# Altium schematic sheet [07] - USB-hub.SchDoc
size A3; DocumentNumber: 9; SheetNumber: 8; SheetTotal: 9
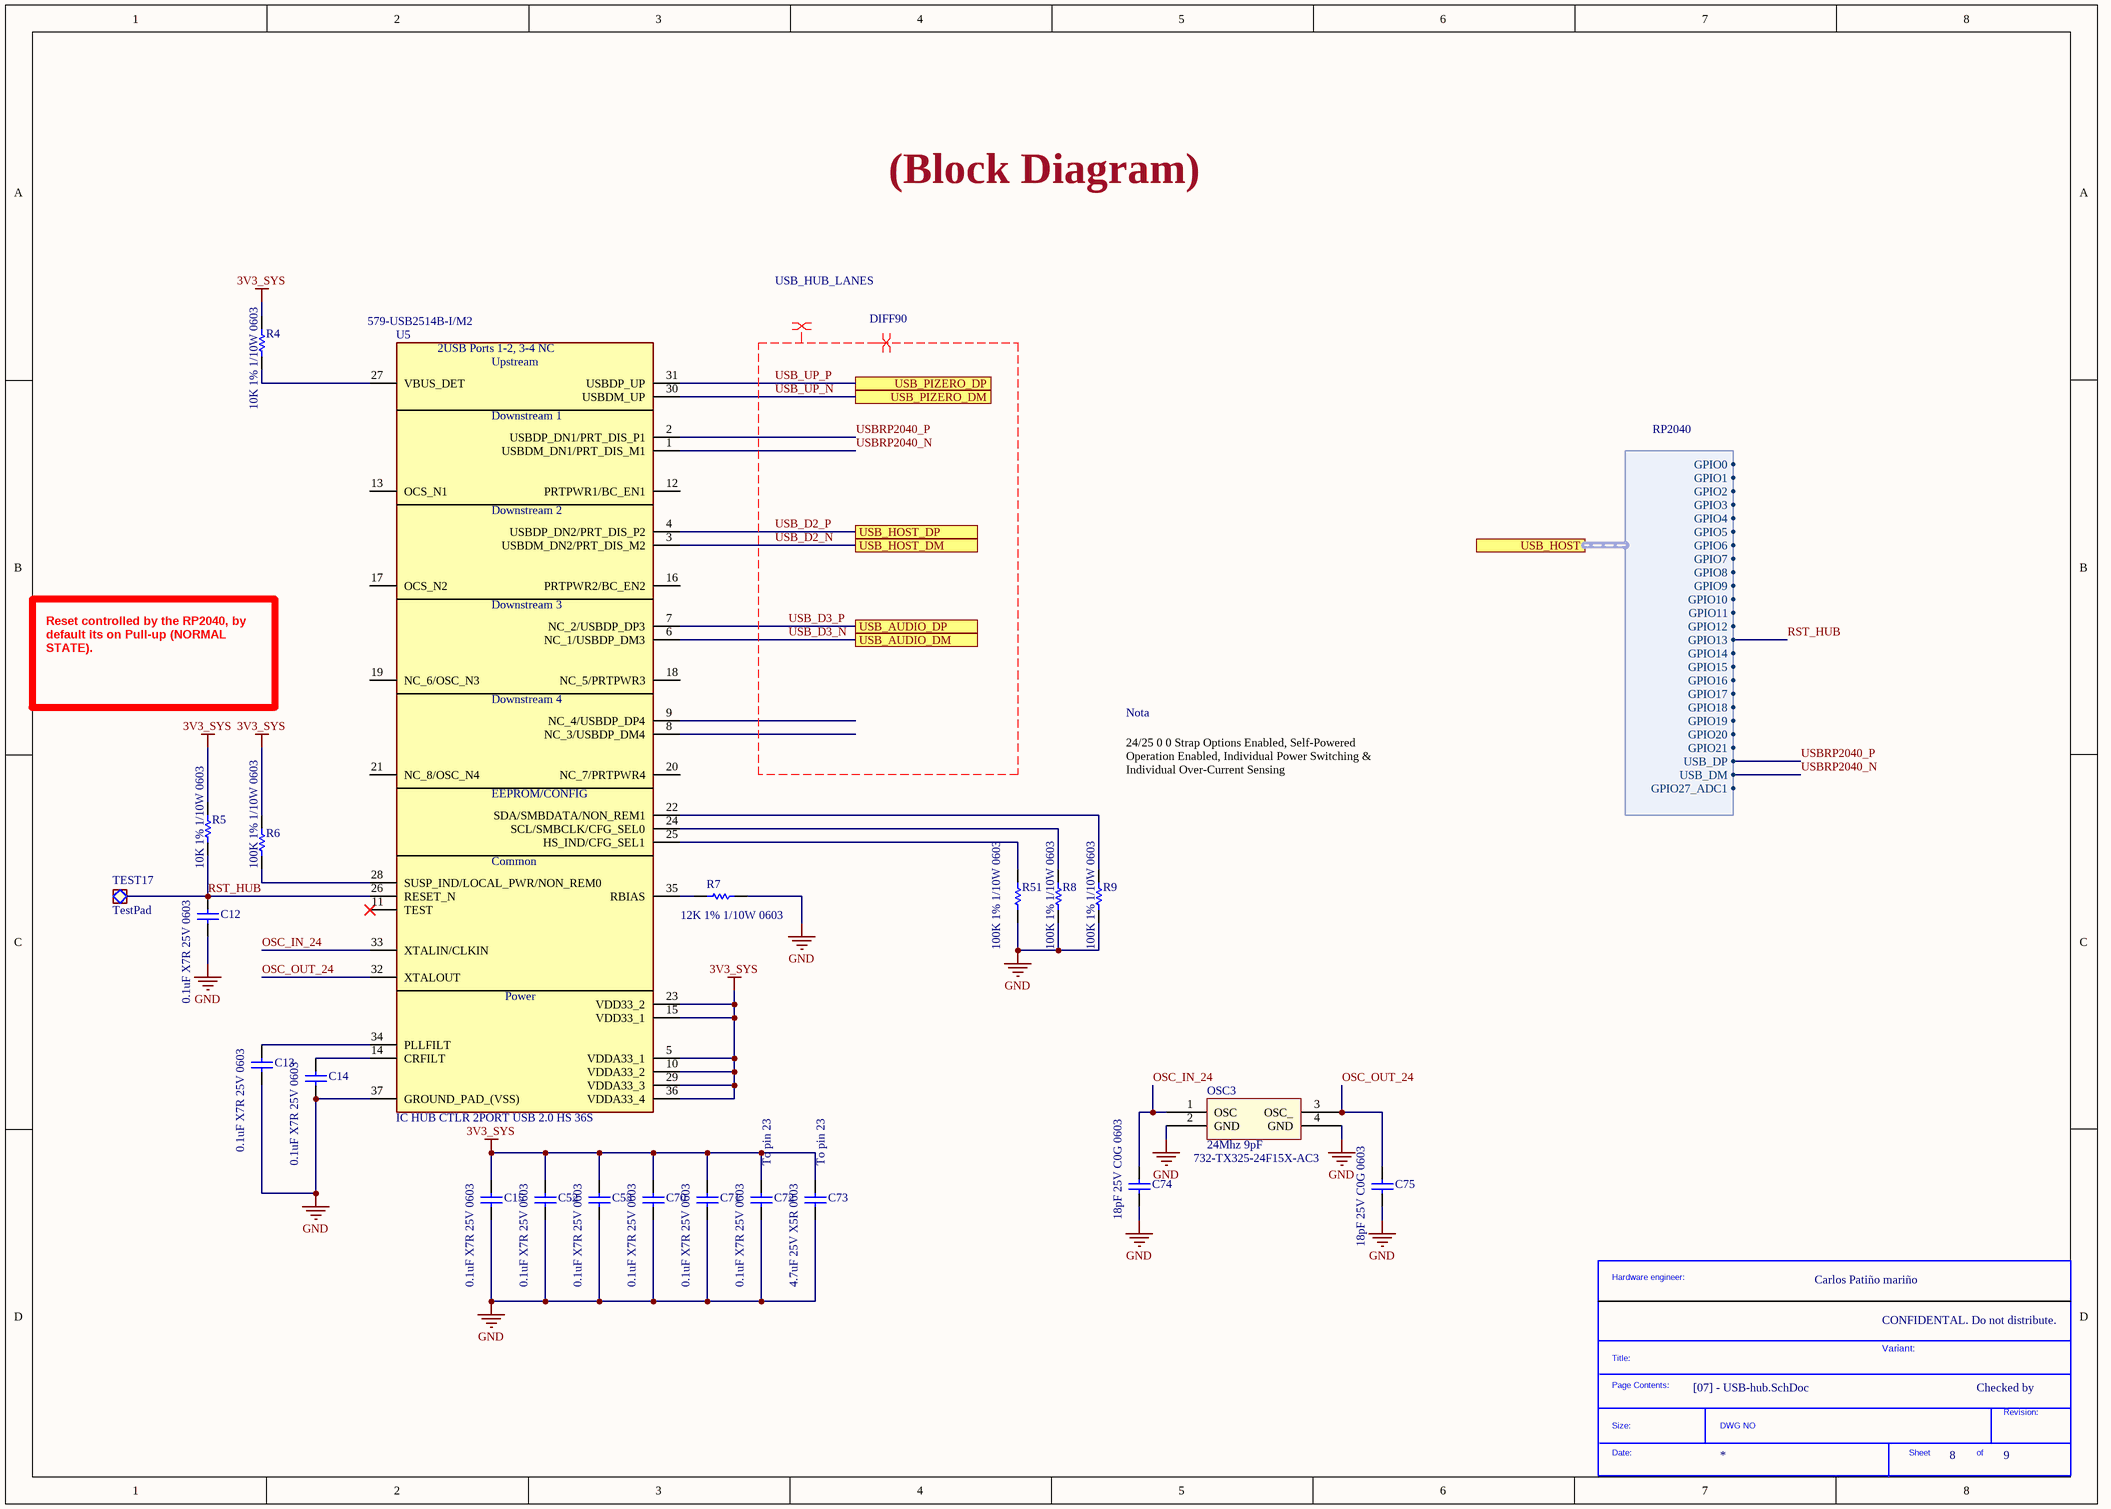
[diagram p0: [07] - USB-hub.SchDoc]

## Parts
*  SDTitleBlock  (value not drawn)  (graphical)
C12  0.1uF X7R 25V 0603  [C 0603/1608]
C13  0.1uF X7R 25V 0603  [C 0603/1608]
C14  0.1uF X7R 25V 0603  [C 0603/1608]
C15  0.1uF X7R 25V 0603  [C 0603/1608]
C52  0.1uF X7R 25V 0603  [C 0603/1608]
C53  0.1uF X7R 25V 0603  [C 0603/1608]
C70  0.1uF X7R 25V 0603  [C 0603/1608]
C71  0.1uF X7R 25V 0603  [C 0603/1608]
C72  0.1uF X7R 25V 0603  [C 0603/1608]
C73  4.7uF 25V X5R 0603  [C 0603/1608]
C74  18pF 25V C0G 0603  [C 0603/1608]
C75  18pF 25V C0G 0603  [C 0603/1608]
OSC3  24Mhz 9pF  Supplier Part Number 1: 732-TX325-24F15X-AC3  [3.2 mm x 2.5 mm(SMD 3225]
R4  10K 1% 1/10W 0603  [R 0603/1608]
R5  10K 1% 1/10W 0603  [R 0603/1608]
R6  100K 1% 1/10W 0603  [R 0603/1608]
R7  12K 1% 1/10W 0603  [R 0603/1608]
R8  100K 1% 1/10W 0603  [R 0603/1608]
R9  100K 1% 1/10W 0603  [R 0603/1608]
R51  100K 1% 1/10W 0603  [R 0603/1608]
TEST17  TestPad  [TestPad]  (no BOM)
U5  IC HUB CTLR 2PORT USB 2.0 HS 36S  Supplier Part Number 1: 579-USB2514B-I/M2  [QFN50P600X600X100-37N-D]

## Ports
USB_AUDIO_DM, USB_AUDIO_DP, USB_HOST (harness RP2040), USB_HOST_DM, USB_HOST_DP, USB_PIZERO_DM, USB_PIZERO_DP

## Harnesses
RP2040: GPIO0, GPIO1, GPIO2, GPIO3, USB_DP, USB_DM, GPIO27_ADC1, GPIO4, GPIO5, GPIO6, GPIO7, GPIO8, GPIO9, GPIO10, GPIO11, GPIO12, GPIO13, GPIO14, GPIO15, GPIO16, GPIO17, GPIO18, GPIO19, GPIO20, GPIO21

## Nets
3V3_SYS: C15.1 C52.1 C53.1 C70.1 C71.1 C72.1 C73.1 R4.2 R5.2 R6.2 U5.5(VDDA33_1) U5.10(VDDA33_2) U5.15(VDD33_1) U5.23(VDD33_2) U5.29(VDDA33_3) U5.36(VDDA33_4)
GND: C12.2 C13.2 C14.2 C15.2 C52.2 C53.2 C70.2 C71.2 C72.2 C73.2 C74.2 C75.2 OSC3.2(GND) OSC3.4(GND) R7.2 R8.1 R9.1 R51.1 U5.37(GROUND_PAD_(VSS))
OSC_IN_24: C74.1 OSC3.1(OSC) U5.33(XTALIN/CLKIN)
OSC_OUT_24: C75.1 OSC3.3(OSC_) U5.32(XTALOUT)
RST_HUB: C12.1 R5.1 TEST17.1 U5.26(RESET_N) ; port USB_HOST.GPIO13
USB_D2_N: U5.3(USBDM_DN2/PRT_DIS_M2) ; port USB_HOST_DM
USB_D2_P: U5.4(USBDP_DN2/PRT_DIS_P2) ; port USB_HOST_DP
USB_D3_N: U5.6(NC_1/USBDP_DM3) ; port USB_AUDIO_DM
USB_D3_P: U5.7(NC_2/USBDP_DP3) ; port USB_AUDIO_DP
USB_UP_N: U5.30(USBDM_UP) ; port USB_PIZERO_DM
USB_UP_P: U5.31(USBDP_UP) ; port USB_PIZERO_DP
USBRP2040_N: U5.1(USBDM_DN1/PRT_DIS_M1) ; port USB_HOST.USB_DM
USBRP2040_P: U5.2(USBDP_DN1/PRT_DIS_P1) ; port USB_HOST.USB_DP
NetC13_1: C13.1 U5.34(PLLFILT)
NetC14_1: C14.1 U5.14(CRFILT)
NetR4_1: R4.1 U5.27(VBUS_DET)
NetR6_1: R6.1 U5.28(SUSP_IND/LOCAL_PWR/NON_REM0)
NetR7_1: R7.1 U5.35(RBIAS)
NetR8_2: R8.2 U5.24(SCL/SMBCLK/CFG_SEL0)
NetR9_2: R9.2 U5.22(SDA/SMBDATA/NON_REM1)
NetR51_2: R51.2 U5.25(HS_IND/CFG_SEL1)

Not connected (* = marked no-connect by the designer): U5 8(NC_3/USBDP_DM4) 9(NC_4/USBDP_DP4) 11(TEST)* 12(PRTPWR1/BC_EN1) 13(OCS_N1) 16(PRTPWR2/BC_EN2) 17(OCS_N2) 18(NC_5/PRTPWR3) 19(NC_6/OSC_N3) 20(NC_7/PRTPWR4) 21(NC_8/OSC_N4)

## Layout directives
differential pair; net class DIFF90: USB_D2_N, USB_D2_P, USB_D3_N, USB_D3_P, USB_UP_N, USB_UP_P, USBRP2040_N, USBRP2040_P
net class USB_HUB_LANES; rule Differential Pairs Routing [Pref Gap = 0.18mm    Min Gap  = 0.18mm    Max Gap  = 0.18mmPref Width = 0.15mm    Min Width  = 0.15mm    Max Width  = 0.15mm]: USB_D2_N, USB_D2_P, USB_D3_N, USB_D3_P, USB_UP_N, USB_UP_P, USBRP2040_N, USBRP2040_P

## Notes on the sheet
- (Block Diagram)
- Reset controlled by the RP2040, by default its on Pull-up (NORMAL STATE).
- Nota
- 24/25 0 0 Strap Options Enabled, Self-Powered Operation Enabled, Individual Power Switching & Individual Over-Current Sensing
- (near C72) To pin 23
- (near C73) To pin 23
- (near C75) CLOCKS (CPU & PCIE)
- Carlos Patiño mariño
- CONFIDENTAL. Do not distribute.
- Variant:
- Checked by
- (in symbol SDTitleBlock) Hardware engineer:; Title:; Page Contents:; Revision:; Size:; DWG NO; Date:; Sheet; of
- (in symbol USB2512B/M2) 2USB Ports 1-2, 3-4 NC; Upstream; Downstream 1; Downstream 2; Downstream 3; Downstream 4; EEPROM/CONFIG; Common; Power

## Library data of the parts
C12-C15 C52 C53 C70-C72 = 885012206071: WURTH ELEKTRONIK         885012206071             SMD Multilayer Ceramic Capacitor, 0603 [1608 Metric], 0.1 F, 25 V,  10%, X7R, WCAP-CSGP Series; Manufacturer: Wurth Electronics; Capacitance: 100nF; Supplier 1: Mouser; Manufacturer Part Number: 885012206071; Stock 1: 202580; Pricing 1: 1=0.1, 10=0.046, 50=0.046, 100=0.041, 1000=0.036, 10000=0.036 (USD); Mount: Surface Mount; Case/Package: 0603; Case Code (Metric): 1608; Case Code (Imperial): 0603; Min Operating Temperature: -55°C; Max Operating Temperature: 125°C; Packaging: Cut Tape; Voltage Rating: 25V; Dielectric: X7R; Tolerance: 10%; Voltage Rating (DC): 25V; Length: 0.063inch; Width: 0.031inch; Thickness: 0.037inch; REACH SVHC: Unknown; Supplier Part Number 1: 710-885012206071
C73 = TMK107BBJ475MA-T: Condensadores de cerámica multicapa (MLCC- SMD/SMT) 0603 25VDC 4.7uF 20% X5R; Manufacturer 1: Taiyo Yuden; Supplier 1: Mouser; Manufacturer Part Number 1: TMK107BBJ475MA-T; Stock 1: 7442; Pricing 1: 1=0.31000, 10=0.15200, 50=0.15200, 100=0.10900, 1000=0.08300, 10000=0.06500 (USD); RoHS: No; Supplier Part Number 1: 963-TMK107BBJ475MA-T
C74 C75 = CC0603JRNPO8BN180: Cap Ceramic 18pF 25V C0G 5% SMD 0603 125C Paper T/R; Manufacturer 1: Yageo; Supplier 1: Mouser; Manufacturer Part Number 1: CC0603JRNPO8BN180; Stock 1: 521; Pricing 1: 1=0.10000, 10=0.04200, 50=0.04200, 100=0.01900, 1000=0.01500, 10000=0.01000 (USD); RoHS: Yes; Mount: Surface Mount; Case/Package: 0603; Weight: 7.1E-05oz; Case Code (Imperial): 0603; Case Code (Metric): 1608; Min Operating Temperature: -55°C; Max Operating Temperature: 125°C; Capacitance: 18pF; Voltage Rating (DC): 25V; Tolerance: 5%; Packaging: Tape and Reel; Dielectric: C0G; Voltage Rating: 25V; Termination: SMD/SMT; Composition: Ceramic; Length: 0.063inch; Width: 0.031inch; Thickness: 0.035inch; ComponentLink1URL: https://datasheet.ciiva.com/13263/upy-gp-np0-16v-to-50v-8-3714-13263805.pdf?src-supplier=Mouser; ComponentLink1Description: https://datasheet.ciiva.com/13263/upy-gp-np0-16v-to-50v-8-3714-13263805.pdf?src-supplier=Mouser; Supplier Part Number 1: 603-CC603JRNPO8BN180
OSC3 = TSX-322524.0000MF15X-AC3: CRYSTAL 24.0000MHZ 9PF SMD; Manufacturer 1: Epson; Frequency Tolerance: 10ppm; ESR (Equivalent Series Resistance): 40R; Frequency Stability: 15ppm; Supplier 1: Mouser; Manufacturer Part Number 1: TSX-322524.0000MF15X-AC3; Stock 1: 68237; Pricing 1: 1=0.34000, 10=0.27500, 50=0.24800, 100=0.22000, 500=0.19300, 1000=0.17600, 2000=0.16500, 5000=0.16000, 10000=0.15400 (USD); RoHS: Yes; Mount: Surface Mount; Case/Package: SMD/SMT; Weight: 0.000564oz; Min Operating Temperature: -40°C; Max Operating Temperature: 85°C; Package Quantity: 250; Frequency: 24MHz; Load Capacitance: 9pF; Packaging: Tape and Reel; Tolerance: 10ppm; Termination: SMD/SMT; Length: 0.126inch; Height: 0.024inch; Width: 0.098inch; Lead Free: Lead Free; ComponentLink1URL: https://support.epson.biz/td/api/doc_check.php?dl=brief_TSX-3225&lang=en&src-supplier=Digi-Key; ComponentLink1Description: https://support.epson.biz/td/api/doc_check.php?dl=brief_TSX-3225&lang=en&src-supplier=Digi-Key; ComponentLink2URL: http://www5.epsondevice.com/en/products/crystal_unit/tsx3225.html#?src-supplier=Mouser; ComponentLink2Description: http://www5.epsondevice.com/en/products/crystal_unit/tsx3225.html#?src-supplier=Mouser; ComponentLink3URL: https://www5.epsondevice.com/en/information/support/pdf/june_2018_psc_masterbook.pdf?src-supplier=Digi-Key; ComponentLink3Description: https://www5.epsondevice.com/en/information/support/pdf/june_2018_psc_masterbook.pdf?src-supplier=Digi-Key
R4 R5 = RC0603FR-0710KL: RES SMD 10K OHM 1% 1/10W 0603; Manufacturer: Yageo; Power (Watts): 0.1W, 1/10W; Temperature Coefficient: ±100ppm/°C; Supplier 1: Digi-Key; Manufacturer Part Number: RC0603FR-0710KL; RoHS: RoHS Compliant; Category: Resistors; Stock 1: 47851285; Pricing 1: 1=0.08, 10=0.013, 100=0.005, 1000=0.00224, 2500=0.00195 (EUR); Packaging: Cut Tape (CT); Part Status: Active; Tolerance: ±1%; Composition: Thick Film; Features: Moisture Resistant; Operating Temperature: -55°C ~ 155°C; Package / Case: 0603 (1608 Metric); Supplier Device Package: 0603; Size / Dimension: 0.063" L x 0.032" W (1.60mm x 0.80mm); Height - Seated (Max): 0.022" (0.55mm); Failure Rate: -; ComponentLink1URL: http://www.yageo.com/documents/recent/PYu-RC_Group_51_RoHS_L_8.pdf; ComponentLink1Description: http://www.yageo.com/documents/recent/PYu-RC_Group_51_RoHS_L_8.pdf; Supplier Part Number 1: 311-10.0KHRCT-ND
R6 R8 R9 R51 = RC0603FR-07100KL: RES SMD 100K OHM 1% 1/10W 0603; Manufacturer: Yageo; Power (Watts): 0.1W, 1/10W; Temperature Coefficient: ±100ppm/°C; Supplier 1: Digi-Key; Manufacturer Part Number: RC0603FR-07100KL; RoHS: RoHS Compliant; Category: Resistors; Stock 1: 6298016; Pricing 1: 1=0.08, 10=0.013, 100=0.005, 1000=0.00224, 2500=0.00195 (EUR); Packaging: Cut Tape (CT); Part Status: Active; Tolerance: ±1%; Composition: Thick Film; Features: Moisture Resistant; Operating Temperature: -55°C ~ 155°C; Package / Case: 0603 (1608 Metric); Supplier Device Package: 0603; Size / Dimension: 0.063" L x 0.032" W (1.60mm x 0.80mm); Height - Seated (Max): 0.022" (0.55mm); Failure Rate: -; ComponentLink1URL: http://www.yageo.com/documents/recent/PYu-RC_Group_51_RoHS_L_8.pdf; ComponentLink1Description: http://www.yageo.com/documents/recent/PYu-RC_Group_51_RoHS_L_8.pdf; Supplier Part Number 1: 311-100KHRCT-ND
R7 = RC0603FR-0712KL: RES SMD 12K OHM 1% 1/10W 0603; Manufacturer: Yageo; Resistance: 12kR; Power Rating: 100mW; Voltage Rating (DC): 50V; Temperature Coefficient: 100ppm/°C; Supplier 1: Mouser; Manufacturer Part Number: RC0603FR-0712KL; Stock 1: 535615; Pricing 1: 1=0.1, 10=0.018, 50=0.018, 100=0.006, 1000=0.005, 10000=0.003 (USD); Case/Package: 0603; Number of Pins: 2; Case Code (Imperial): 0603; Case Code (Metric): 1608; Min Operating Temperature: -55°C; Max Operating Temperature: 155°C; Tolerance: 1%; Packaging: Tape and Reel; Voltage Rating: 50V; Package Quantity: 1; Termination: SMD/SMT; Composition: Thick Film; Number of Terminations: 2; Military Standard: Not; Max Power Dissipation: 100mW; Features: Moisture Resistant; Length: 0.063inch; Height: 0.022inch; Width: 0.031inch; Depth: 0.8mm; REACH SVHC: No SVHC; Lead Free: Lead Free; ComponentLink1URL: http://documents.rs-components.com/techlib://itc_doclist_GB.htm?stockno=5049218; ComponentLink1Description: http://documents.rs-components.com/techlib://itc_doclist_GB.htm?stockno=5049218; ComponentLink2URL: http://www.yageo.com/documents/recent/PYu-RC_Group_51_RoHS_L_10.pdf; ComponentLink2Description: http://www.yageo.com/documents/recent/PYu-RC_Group_51_RoHS_L_10.pdf; ComponentLink3URL: http://www.farnell.com/datasheets/1868787.pdf; ComponentLink3Description: http://www.farnell.com/datasheets/1868787.pdf; ComponentLink4URL: http://www.farnell.com/datasheets/443971.pdf; ComponentLink4Description: http://www.farnell.com/datasheets/443971.pdf; ComponentLink5URL: http://www.yageo.com/documents/recent/PYu-RC_Group_51_RoHS_L_9.pdf; ComponentLink5Description: http://www.yageo.com/documents/recent/PYu-RC_Group_51_RoHS_L_9.pdf; Supplier Part Number 1: 603-RC0603FR-0712KL
TEST17 = PP_SMT_ROUND_2MM: Probe Pad, SMT, ROUND, 2.0MM
U5 = USB2512B/M2: Manufacturer 1: Microchip; Manufacturer Part Number 1: USB2514B-I/M2; Operating Supply Current: 70mA; Min Supply Voltage: 3V; Max Supply Voltage: 3.6V; Data Rate: 480Mbps; Number of Ports: 4; USB Standard: USB 2.0; ComponentLink1URL: http://www.farnell.com/datasheets/2032129.pdf?src-supplier=Farnell; ComponentLink1Description: http://www.farnell.com/datasheets/2032129.pdf?src-supplier=Farnell; ComponentLink2URL: http://ww1.microchip.com/downloads/en/DeviceDoc/00001692B.pdf?src-supplier=Avnet; ComponentLink2Description: http://ww1.microchip.com/downloads/en/DeviceDoc/00001692B.pdf?src-supplier=Avnet; ComponentLink3URL: http://www.microchip.com/mymicrochip/filehandler.aspx?ddocname=en562310&src-supplier=Digi-Key; ComponentLink3Description: http://www.microchip.com/mymicrochip/filehandler.aspx?ddocname=en562310&src-supplier=Digi-Key; Supplier 1: Mouser; Stock 1: 2735; Pricing 1: 1=3.02000, 10=2.98000, 25=2.52000, 50=2.52000, 100=2.43000, 1000=2.43000, 10000=2.27000 (USD); RoHS: Yes; Number of Pins: 36; Min Operating Temperature: -40°C; Max Operating Temperature: 85°C; Packaging: Tray; Interface: USB; REACH SVHC: No SVHC; Lead Free: Lead Free; ComponentLink4URL: http://www.farnell.com/datasheets/2032129.pdf?src-supplier=Element14; ComponentLink4Description: http://www.farnell.com/datasheets/2032129.pdf?src-supplier=Element14